# Altium project Glove Controller.PrjPcb (part 5 of 5)
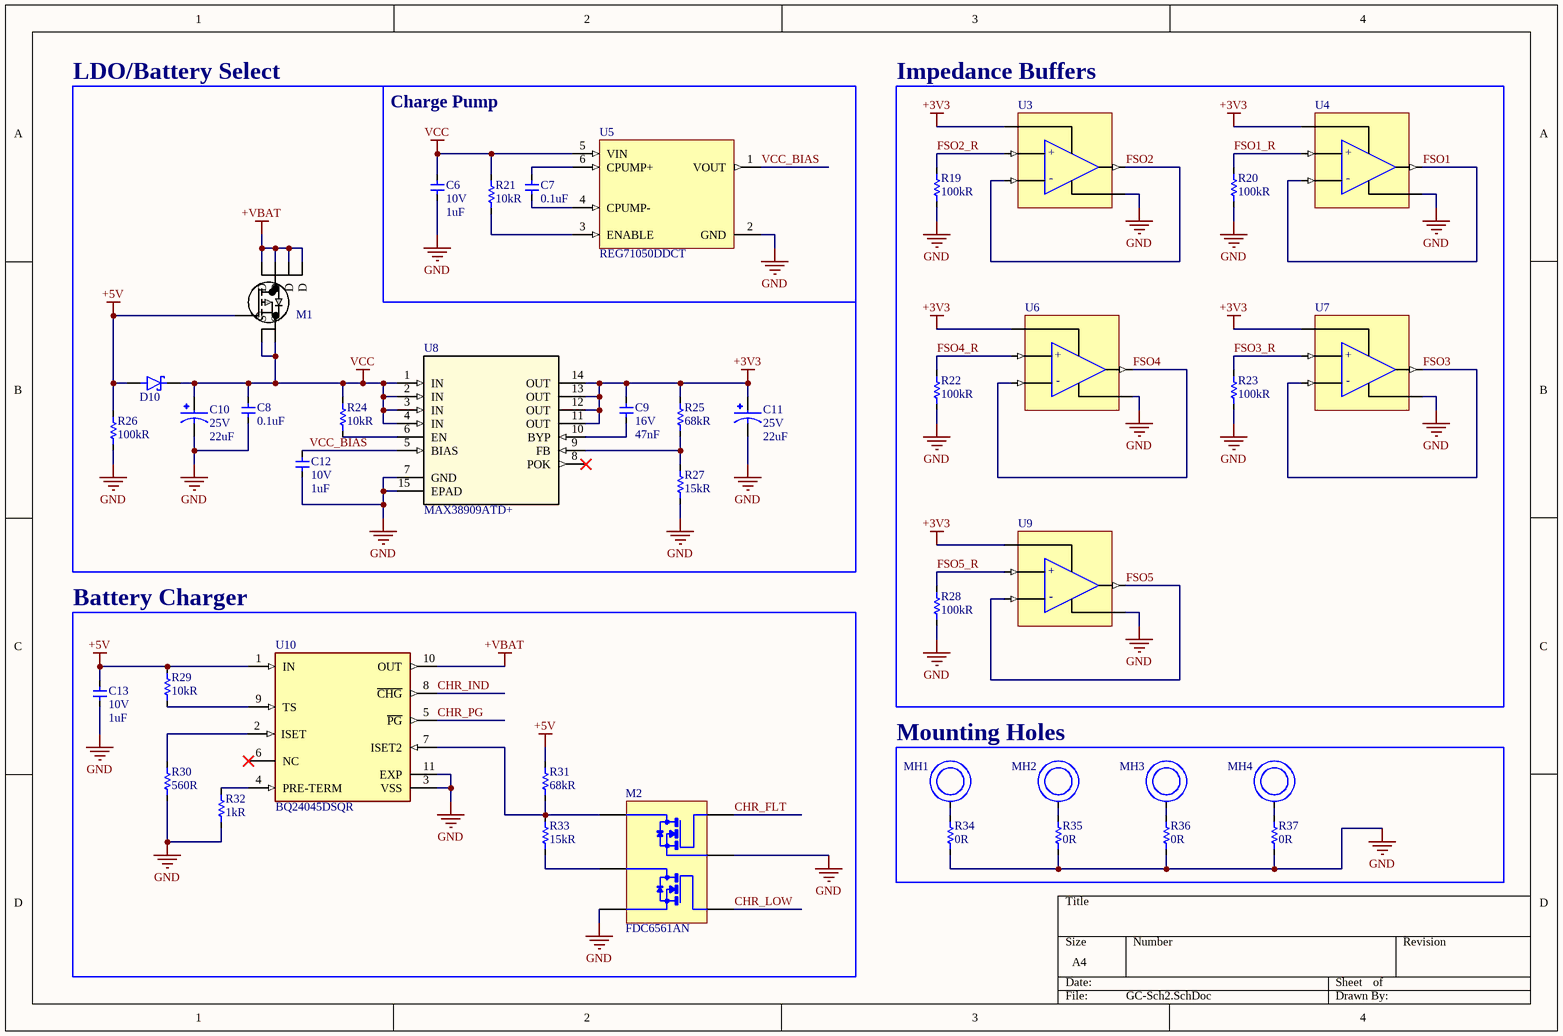
[diagram p5: GC-Sch2.SchDoc]

## Sheet GC-Sch2.SchDoc (continued)

### Library data of the parts (continued)
U10 = U-BQ24045DSQR: Power Supply Support Circuit, Adjustable, 1 Channel, 6.65, PDSO10; Manufacturer: Texas Instruments; Package Body Material: Plastic; Adjustable Threshold: Yes; Number of Channels: 1; Power Supplies: 5V; Supply Current-Max (Isup): 1A; Supply Voltage-Max (Vsup): 28V; Supply Voltage-Min (Vsup): 3.5V; Qualification Status: Not Qualified; Supplier 1: Mouser; Supplier Part Number 1: 595-BQ24045DSQR; Manufacturer Part Number: BQ24045DSQR; RoHS: Yes; Category: Battery Management; Stock: 6811; Pricing: 1=1.05, 10=0.926, 50=0.926, 100=0.768, 1000=0.563, 10000=0.452 (USD); Package Code: HVSON; Number of Pins: 10; Package Shape: Square; Terminal Finish: Nickel; JESD-609 Code: e4; Analog IC - Other Type: POWER SUPPLY SUPPORT CIRCUIT; JESD-30 Code: S-PDSO-N10; Moisture Sensitivity Level: 2; Number of Functions: 1; Package Style: SMALL OUTLINE, HEAT SINK/SLUG, VERY THIN PROFILEMeter; Peak Reflow Temperature (Cel): 260°C; Supply Voltage-Nom (Vsup): 5V; Surface Mount: Yes; Terminal Form: No Lead; Terminal Position: DUAL; Length: 2mm; Width: 2mm; Height - Seated (Max): 0.8mm; Terminal Pitch: 0.4mm; Reach SVHC Compliant: Yes; RoHS Compliant: Yes; ComponentLink1URL: https://www.ti.com:443/lit/ds/symlink/bq24040.pdf?src-supplier=IHS+Markit; ComponentLink1Description: https://www.ti.com:443/lit/ds/symlink/bq24040.pdf?src-supplier=IHS+Markit; ComponentLink2URL: https://datasheet.ciiva.com/15367/slus941e-317338-15367177.pdf?src-supplier=Mouser; ComponentLink2Description: https://datasheet.ciiva.com/15367/slus941e-317338-15367177.pdf?src-supplier=Mouser; ComponentLink3URL: https://datasheet.ciiva.com/15047/bq24045-15047702.pdf?src-supplier=Digikey; ComponentLink3Description: https://datasheet.ciiva.com/15047/bq24045-15047702.pdf?src-supplier=Digikey

### Notes on the sheet
- (in symbol U-MCP6071T-E/OT) +; -

## Nets that join several sheets
+3V3: GC-Sch (16 pins), GC-Sch2 (12 pins)
+5V: GC-Sch (D1.C R3.1 R5.1), GC-Sch2 (7 pins)
+VBAT: GC-Sch (J3.1 R15.1 R16.1), GC-Sch2 (5 pins)
GND: GC-Sch (36 pins), GC-Sch2 (31 pins)
CHR_FLT: GC-Sch (U2.13), GC-Sch2 (M2.3)
CHR_IND: GC-Sch (D8.C), GC-Sch2 (U10.8)
CHR_LOW: GC-Sch (U2.14), GC-Sch2 (M2.1)
CHR_PG: GC-Sch (D9.C), GC-Sch2 (U10.5)
FSO1: GC-Sch (U1.14), GC-Sch2 (U4.1 U4.4)
FSO1_R: GC-Sch (J2.10), GC-Sch2 (R20.2 U4.3)
FSO2: GC-Sch (U1.16), GC-Sch2 (U3.1 U3.4)
FSO2_R: GC-Sch (J2.7), GC-Sch2 (R19.2 U3.3)
FSO3: GC-Sch (U1.23), GC-Sch2 (U7.1 U7.4)
FSO3_R: GC-Sch (J2.5), GC-Sch2 (R23.2 U7.3)
FSO4: GC-Sch (U1.24), GC-Sch2 (U6.1 U6.4)
FSO4_R: GC-Sch (J2.2), GC-Sch2 (R22.2 U6.3)
FSO5: GC-Sch (U1.26), GC-Sch2 (U9.1 U9.4)
FSO5_R: GC-Sch (J2.1), GC-Sch2 (R28.2 U9.3)